# Altium schematic sheet Sheet2.SchDoc
size A4
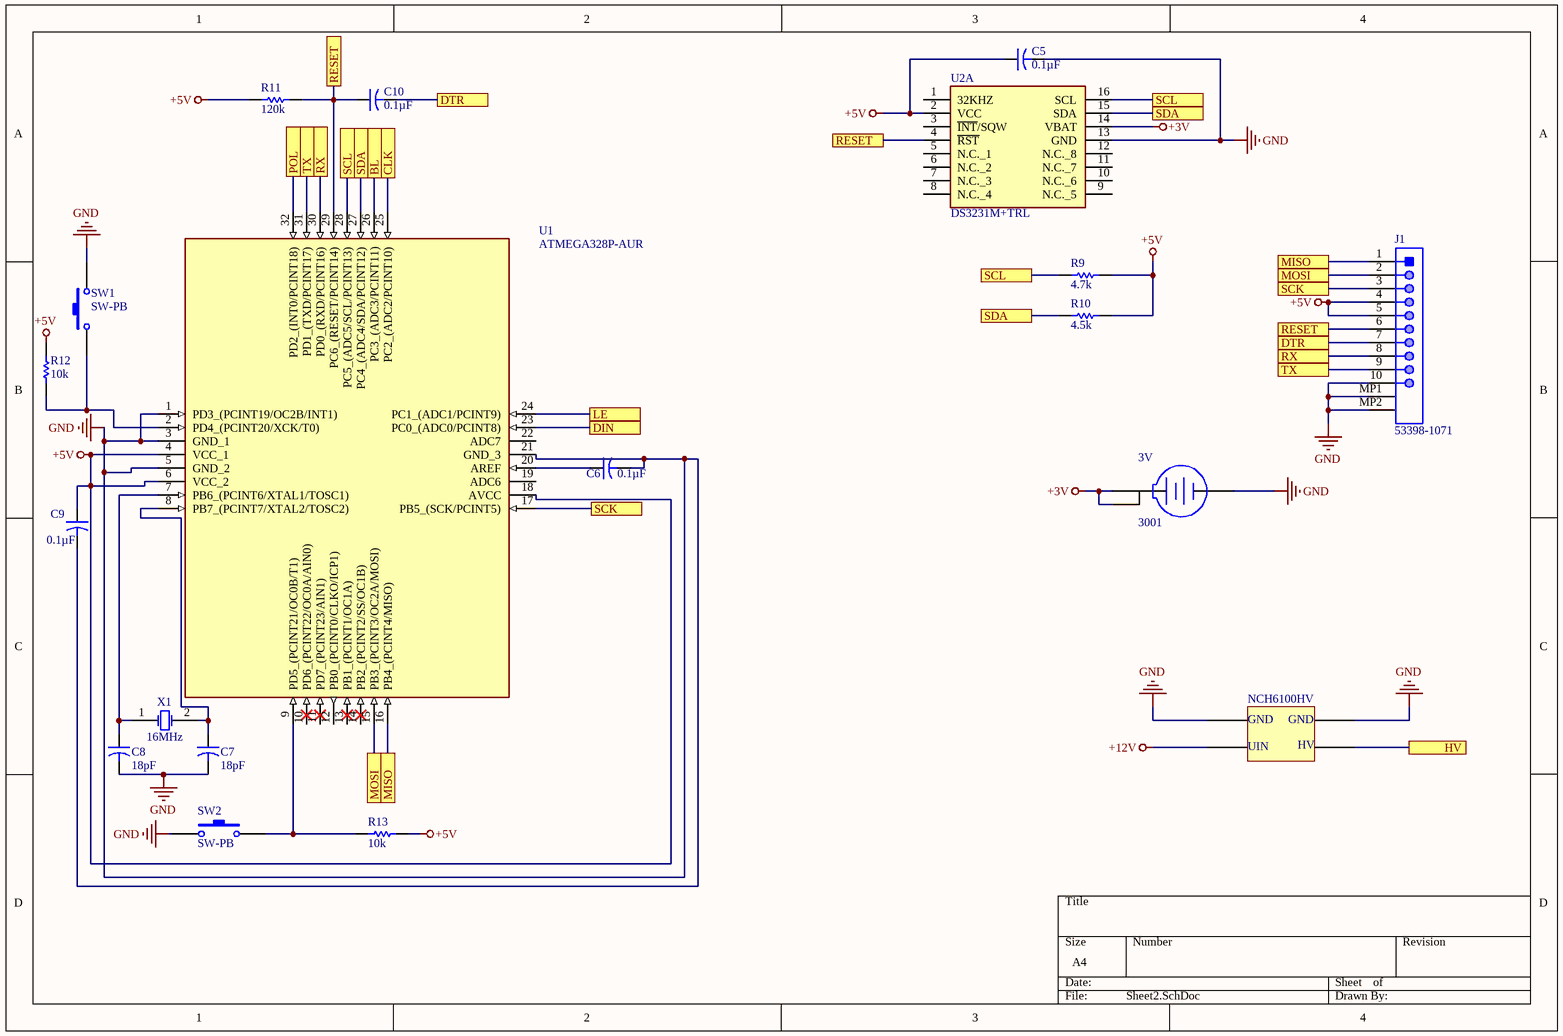
[diagram p0: Sheet2.SchDoc]

## Parts
3V  3001  [KSTN-3001_V]
C5  value 0.1µF  [CAPR5-4X5]
C6  value 0.1µF  [CAPR5-4X5]
C7  value 18pF  [CAPR5-4X5]
C8  value 18pF  [CAPR5-4X5]
C9  value 0.1µF  [CAPR5-4X5]
C10  value 0.1µF  [CAPR5-4X5]
J1  53398-1071  [MOLX-53398-1071_V]
NCH6100HV  NCH6100HV  [NCH6100HV]  (value not drawn)
R9  value 4.7k  [AXIAL-0.3]
R10  value 4.5k  [AXIAL-0.3]
R11  value 120k  [AXIAL-0.3]
R12  value 10k  [AXIAL-0.3]
R13  value 10k  [AXIAL-0.3]
SW1  SW-PB  [SPST-2]
SW2  SW-PB  [SPST-2]
U1  ATMEGA328P-AUR  [QFP80P900X900X120-32N]
U2A  DS3231M+TRL  [SOIC127P1032X265-16N]
X1  16MHz  [R38]

## Ports
BL, CLK, DIN, DTR, HV, LE, MISO, MOSI, POL, RESET, RX, SCK, SCL, SDA, TX

## Nets
+3V: 3V.1(+) 3V.2(+) U2A.14(VBAT)
+5V: C5.1 C9.1 J1.4 J1.5 R9.2 R10.2 R11.1 R12.2 R13.1 U1.4(VCC_1) U1.6(VCC_2) U1.18(AVCC) U2A.2(VCC)
GND: 3V.3(-) C5.2 C6.2 C7.2 C8.2 C9.2 J1.10 J1.MP1 J1.MP2 NCH6100HV.21 SW1.2 SW2.1 U1.1(PD3_(PCINT19/OC2B/INT1)) U1.3(GND_1) U1.5(GND_2) U1.21(GND_3) U2A.13(GND)
BL: U1.26(PC3_(ADC3/PCINT11)) ; port BL
CLK: U1.25(PC2_(ADC2/PCINT10)) ; port CLK
DIN: U1.23(PC0_(ADC0/PCINT8)) ; port DIN
DTR: C10.2 J1.7 ; port DTR
HV: NCH6100HV.22 ; port HV
LE: U1.24(PC1_(ADC1/PCINT9)) ; port LE
MISO: J1.1 U1.16(PB4_(PCINT4/MISO)) ; port MISO
MOSI: J1.2 U1.15(PB3_(PCINT3/OC2A/MOSI)) ; port MOSI
POL: U1.32(PD2_(INT0/PCINT18)) ; port POL
RESET: C10.1 J1.6 R11.2 U1.29(PC6_(RESET/PCINT14)) U2A.4(~{RST}) ; port RESET
RX: J1.8 U1.30(PD0_(RXD/PCINT16)) ; port RX
SCK: J1.3 U1.17(PB5_(SCK/PCINT5)) ; port SCK
SCL: R9.1 U1.28(PC5_(ADC5/SCL/PCINT13)) U2A.16(SCL) ; port SCL
SDA: R10.1 U1.27(PC4_(ADC4/SDA/PCINT12)) U2A.15(SDA) ; port SDA
TX: J1.9 U1.31(PD1_(TXD/PCINT17)) ; port TX
NetC6_1: C6.1 U1.20(AREF)
NetC7_1: C7.1 U1.8(PB7_(PCINT7/XTAL2/TOSC2)) X1.2(OSC2)
NetC8_1: C8.1 U1.7(PB6_(PCINT6/XTAL1/TOSC1)) X1.1(OSC1)
NetR12_1: R12.1 SW1.1 U1.2(PD4_(PCINT20/XCK/T0))
NetR13_2: R13.2 SW2.2 U1.9(PD5_(PCINT21/OC0B/T1))

Not connected (* = marked no-connect by the designer): NCH6100HV 19 20; U1 10(PD6_(PCINT22/OC0A/AIN0)) 11(PD7_(PCINT23/AIN1)) 12(PB0_(PCINT0/CLKO/ICP1)) 13(PB1_(PCINT1/OC1A)) 14(PB2_(PCINT2/SS/OC1B)) 19(ADC6) 22(ADC7); U2A 1(32KHZ) 3(~{INT}/SQW) 5(N.C._1) 6(N.C._2) 7(N.C._3) 8(N.C._4) 9(N.C._5) 10(N.C._6) 11(N.C._7) 12(N.C._8)

## Notes on the sheet
- (in symbol NCH6100HV) GND; UIN; HV

## Library data of the parts
3V = CMP-2000-05463-1: Holder Battery Coin, 12 mm, 2-Pin THD, RoHS; Manufacturer: Keystone; Package Reference: 3001; Package Description: 2-Pin Through Hole Device, Body 13.21 x 12.07 mm; Datasheet Version: Rev. H, 09/2006; Datasheet URL: https://datasheet.ciiva.com/3/3001-3954.pdf; Mounting Technology: ThroughHole; Manufacturer URL: http://www.keyelco.com/
C5-C10 = Cap2: Capacitor; Published: 23-Sep-2002; PackageReference: CAPR5-4X5; Publisher: Altium Limited; PackageDescription: Capacitor; 2 Leads
J1 = CMP-2000-05635-1: Male Header, Pitch 1.25 mm, 1 x 10 Position, Height 4.7 mm, -40 to 85 degC, RoHS, Tape and Reel; Manufacturer: Molex; Mounting Angle: Vertical; Pitch: 1.25mm; Voltage Rating: 125V; Current Rating: 1A; Number of Rows: 1Row; Housing Material: Nylon; Mounting Technology: SurfaceMount; Mounting Style: SMD; Contact Material: PhosphorBronze; Product: Headers; Datasheet URL: http://www.molex.com/pdm_docs/sd/533981071_sd.pdf; Manufacturer URL: http://www.molex.com/; Datasheet Version: Rev. J, 09/2015; Factory Pack Quantity: 1000; Brand: Molex; Packaging: Reel; Product Category: Headers&WireHousings; Contact Gender: Pin(Male); Number of Positions: 10Position; RoHS: Details; Contact Plating: Tin; Package Description: Male Header, Pitch 1.25 mm, 1 x 10 Position, Height 4.7 mm; Series: 53398; Type: Shrouded; Package Reference: 53398-1071; Tradename: PicoBlade; Termination Style: SMD
R9-R13 = Res1: Resistor; Published: 8-Jun-2000; LatestRevisionDate: 17-Jul-2002; LatestRevisionNote: Re-released for DXP Platform.; PackageReference: AXIAL-0.3; Publisher: Altium Limited; PackageDescription: Axial Device, Thru-Hole; 2 Leads; 0.3 in Pin Spacing
SW1 SW2 = SW-PB: Switch; Published: 24-Mar-1999; LatestRevisionDate: 17-Jul-2002; LatestRevisionNote: Re-released for DXP Platform.; PackageReference: SPST-2; Publisher: Altium Limited; PackageDescription: Switch; 2 Leads
U1 = ATMEGA328P-AUR: Integrated Circuit; Manufacturer_Name: Microchip; Datasheet Link: http://www.farnell.com/datasheets/1693866.pdf; Height: 1.2mm; Manufacturer_Part_Number: ATMEGA328P-AUR; Mouser Part Number: 556-ATMEGA328P-AUR; Mouser Price/Stock: https://www.mouser.com/Search/Refine.aspx?Keyword=556-ATMEGA328P-AUR; RS Part Number: 1773264P; RS Price/Stock: http://uk.rs-online.com/web/p/products/1773264P
U2A = DS3231M+TRL: Integrated Circuit; Manufacturer_Name: Maxim Integrated; Datasheet Link: http://componentsearchengine.com/Datasheets/1/DS3231M+TRL.pdf; Height: 2.65mm; Manufacturer_Part_Number: DS3231M+TRL; Mouser Part Number: 700-DS3231M+TRL; Mouser Price/Stock: https://www.mouser.com/Search/Refine.aspx?Keyword=700-DS3231M%2BTRL
X1 = XTAL: Crystal Oscillator; Published: 8-Jun-2000; LatestRevisionDate: 17-Jul-2002; LatestRevisionNote: Re-released for DXP Platform.; PackageReference: R38; Publisher: Altium Limited; PackageDescription: Crystal, Thru-Hole; 2 Leads; Body 3.1 x 8.2 mm (Dia.xH)